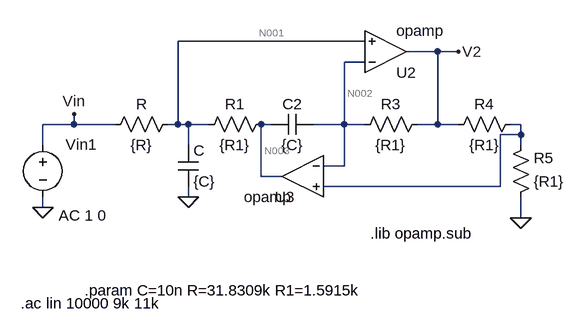
[diagram p0: schematic Draft1.asc]
Draft1.asc, the LTspice schematic file:
Version 4
SHEET 1 1000 680
WIRE 112 80 -176 80
WIRE 224 96 176 96
WIRE 256 96 224 96
WIRE 112 112 80 112
WIRE -336 208 -336 192
WIRE -336 208 -384 208
WIRE -272 208 -336 208
WIRE -176 208 -176 80
WIRE -176 208 -192 208
WIRE -160 208 -176 208
WIRE -128 208 -160 208
WIRE -32 208 -48 208
WIRE 80 208 80 112
WIRE 80 208 32 208
WIRE 112 208 80 208
WIRE 224 208 224 96
WIRE 224 208 192 208
WIRE 256 208 224 208
WIRE 352 208 336 208
WIRE 352 224 352 208
WIRE 352 224 320 224
WIRE -384 240 -384 208
WIRE -160 240 -160 208
WIRE 352 240 352 224
WIRE 80 272 80 208
WIRE 80 272 48 272
WIRE -48 288 -48 208
WIRE -16 288 -48 288
WIRE 320 304 320 224
WIRE 320 304 48 304
WIRE -160 320 -160 304
WIRE -384 336 -384 320
WIRE 352 352 352 320
FLAG -384 336 0
FLAG -336 192 Vin
FLAG -160 320 0
FLAG 256 96 V2
FLAG 352 352 0
SYMBOL OpAmps\\opamp 144 160 M180
SYMATTR InstName U2
SYMBOL OpAmps\\opamp 16 224 M0
WINDOW 0 12 96 Left 2
SYMATTR InstName U3
SYMBOL res 352 192 R90
WINDOW 0 0 56 VBottom 2
WINDOW 3 32 56 VTop 2
SYMATTR InstName R4
SYMATTR Value {R1}
SYMBOL res -176 192 R90
WINDOW 0 0 56 VBottom 2
WINDOW 3 32 56 VTop 2
SYMATTR InstName R
SYMATTR Value {R}
SYMBOL res -32 192 R90
WINDOW 0 0 56 VBottom 2
WINDOW 3 32 56 VTop 2
SYMATTR InstName R1
SYMATTR Value {R1}
SYMBOL res 208 192 R90
WINDOW 0 0 56 VBottom 2
WINDOW 3 32 56 VTop 2
SYMATTR InstName R3
SYMATTR Value {R1}
SYMBOL res 336 336 M180
WINDOW 0 36 76 Left 2
WINDOW 3 36 40 Left 2
SYMATTR InstName R5
SYMATTR Value {R1}
SYMBOL cap 32 192 R90
WINDOW 0 0 32 VBottom 2
WINDOW 3 32 32 VTop 2
SYMATTR InstName C2
SYMATTR Value {C}
SYMBOL voltage -384 224 R0
WINDOW 123 24 124 Left 2
WINDOW 39 0 0 Left 0
WINDOW 0 35 15 Left 2
SYMATTR Value2 AC 1 0
SYMATTR InstName Vin1
SYMATTR Value ""
SYMBOL cap -176 240 R0
SYMATTR InstName C
SYMATTR Value {C}
TEXT 120 376 Left 2 !.lib opamp.sub
TEXT -320 464 Left 2 !.param C=10n R=31.8309k R1=1.5915k
TEXT -418 484 Left 2 !.ac lin 10000 9k 11k

The netlist it stands for:
* Draft1.asc
XU2 N002 N001 V2 opamp Aol=100K GBW=10Meg  ; pins invin noninvin out
XU3 N002 N004 N003 opamp Aol=100K GBW=10Meg  ; pins invin noninvin out
R4 N004 V2 {R1}
R N001 Vin {R}
R1 N003 N001 {R1}
R3 V2 N002 {R1}
R5 0 N004 {R1}
C2 N002 N003 {C}
Vin1 Vin 0 AC 1 0
C N001 0 {C}
.lib opamp.sub
.param C=10n R=31.8309k R1=1.5915k
.ac lin 10000 9k 11k
.backanno
.end

* Results of the author's LTspice run, read from the files saved beside the schematic
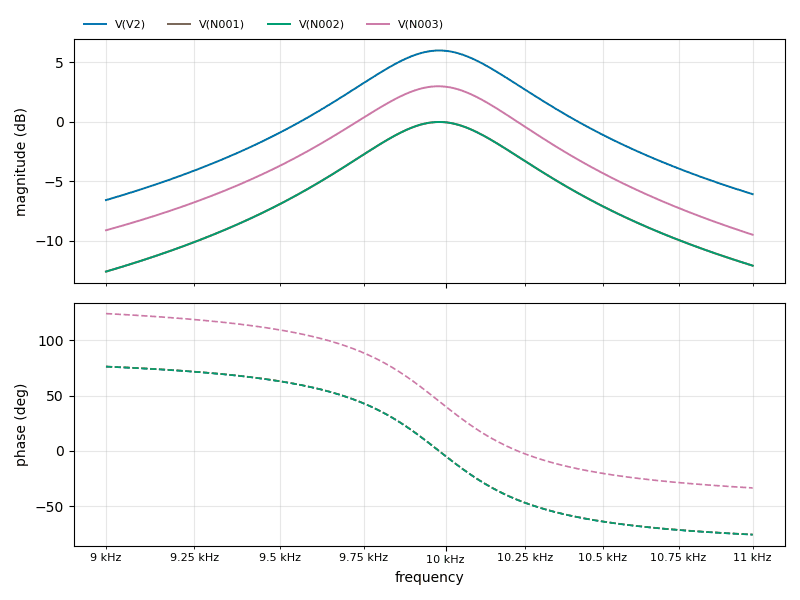
[diagram p1: AC Analysis of Draft1.asc, plotted from the saved traces]
* AC Analysis, 1 run:
*   V(V2): -6.58 dB at 9 kHz, -6.08 dB at 11 kHz, peak 6.00 dB at 9.98 kHz, 3 dB below the peak at 9.734 kHz and 10.23 kHz
*   V(N001): -12.59 dB at 9 kHz, -12.09 dB at 11 kHz, peak -0.01 dB at 9.98 kHz, 3 dB below the peak at 9.734 kHz and 10.23 kHz
*   V(N002): -12.59 dB at 9 kHz, -12.09 dB at 11 kHz, peak -0.01 dB at 9.98 kHz, 3 dB below the peak at 9.734 kHz and 10.23 kHz
*   V(N003): -9.12 dB at 9 kHz, -9.49 dB at 11 kHz, peak 2.99 dB at 9.977 kHz, 3 dB below the peak at 9.727 kHz and 10.23 kHz